# Altium project project_name.PrjPcb
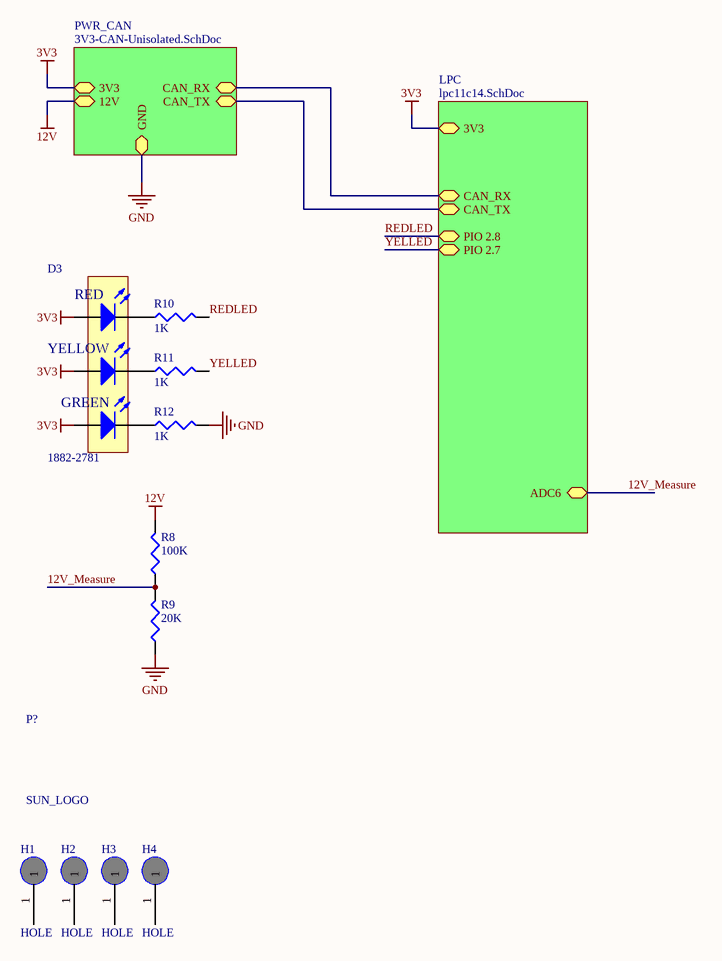
[diagram p0: project_name_lpc11c14.SchDoc]
6 sheets, 96 parts. Net scope: hierarchical (ports join the sheet entries above them; power ports are global).
Board files: project_name_faceplate.PcbDoc, CAN_faceplate.PcbDoc, project_name.PcbDoc
Sheets:
  project_name_lpc11c14.SchDoc
    LPC = lpc11c14.SchDoc
    PWR_CAN = 3V3-CAN-Unisolated.SchDoc
      U_3V-Switcher-50mA = 3V-Switcher-50mA.SchDoc
  project_name_lpc1768.SchDoc
    Unisolated CAN = 3V3-CAN-Unisolated.SchDoc
      U_3V-Switcher-50mA = 3V-Switcher-50mA.SchDoc
    LPC1768 = lpc1768.SchDoc

## Sheet project_name_lpc11c14.SchDoc
size A

### Parts
(Parts that share a designator on the sheet are numbered #1, #2 ... from top to bottom, then left to right.)
D3  1882-2781  [LED_TRILEVEL]
H1#1  HOLE  [M2.5]
H2#1  HOLE  [M2.5]
H3#1  HOLE  [M2.5]
H4#1  HOLE  [M2.5]
P?  SUN_LOGO  [SUNSWIFTLOGO]
R8  100K  [0603]
R9  20K  [0603]
R10  1K  [0603]
R11#1  1K  [0603]
R12#1  1K  [0603]

### Sub-sheets
LPC = lpc11c14.SchDoc: 3V3 (bidir), CAN_RX (bidir), CAN_TX (bidir), ADC6 (bidir), PIO 2.8 (bidir), PIO 2.7 (bidir)
PWR_CAN = 3V3-CAN-Unisolated.SchDoc: CAN_RX (bidir), CAN_TX (bidir), 3V3 (bidir), 12V (bidir), GND (bidir)

### Nets
3V3: D3.4(A) D3.5(A) D3.6(A) ; sheet LPC/3V3, sheet PWR_CAN/3V3  [project net VDDA]
12V: R8.2 ; sheet PWR_CAN/12V
GND: R9.1 R12#1.2 ; sheet PWR_CAN/GND  [project net VREFN]
12V_Measure: R8.1 R9.2 ; sheet LPC/ADC6
REDLED: R10.2 ; sheet LPC/PIO 2.8
YELLED: R11#1.2 ; sheet LPC/PIO 2.7
NetD3_1: D3.1(K) R12#1.1
NetD3_2: D3.2(K) R11#1.1
NetD3_3: D3.3(K) R10.1
NetU1_PWR_CAN_1: sheet LPC/CAN_TX, sheet PWR_CAN/CAN_TX
NetU1_PWR_CAN_4: sheet LPC/CAN_RX, sheet PWR_CAN/CAN_RX

Not connected (* = marked no-connect by the designer): H1#1 1; H2#1 1; H3#1 1; H4#1 1

### Notes on the sheet
- (in symbol LED-TRILEVEL) RED; YELLOW; GREEN

### Library data of the parts
D3 = LED-TRILEVEL: Three level LED; Needed?: Farnell - Low Stock; Farnell: 1461596; Farnell Price: 4.56
H1#1 H2#1 H3#1 H4#1 = HOLE: Needed?: NO - Footprint
R8-R10 R11#1 R12#1 = RES1: Resistor; Needed?: NO - HW LAB
  R8: Value: 100k
  R9: Value: 20k
  R10 R11#1 R12#1: Value: 1k

## Sheet lpc11c14.SchDoc
size A4; Organization: UNSW Solar Racing Team; Address3: UNSW; Address4: Sydney NSW 2052; Address2: Electrical Engineering; Address1: Rm 109
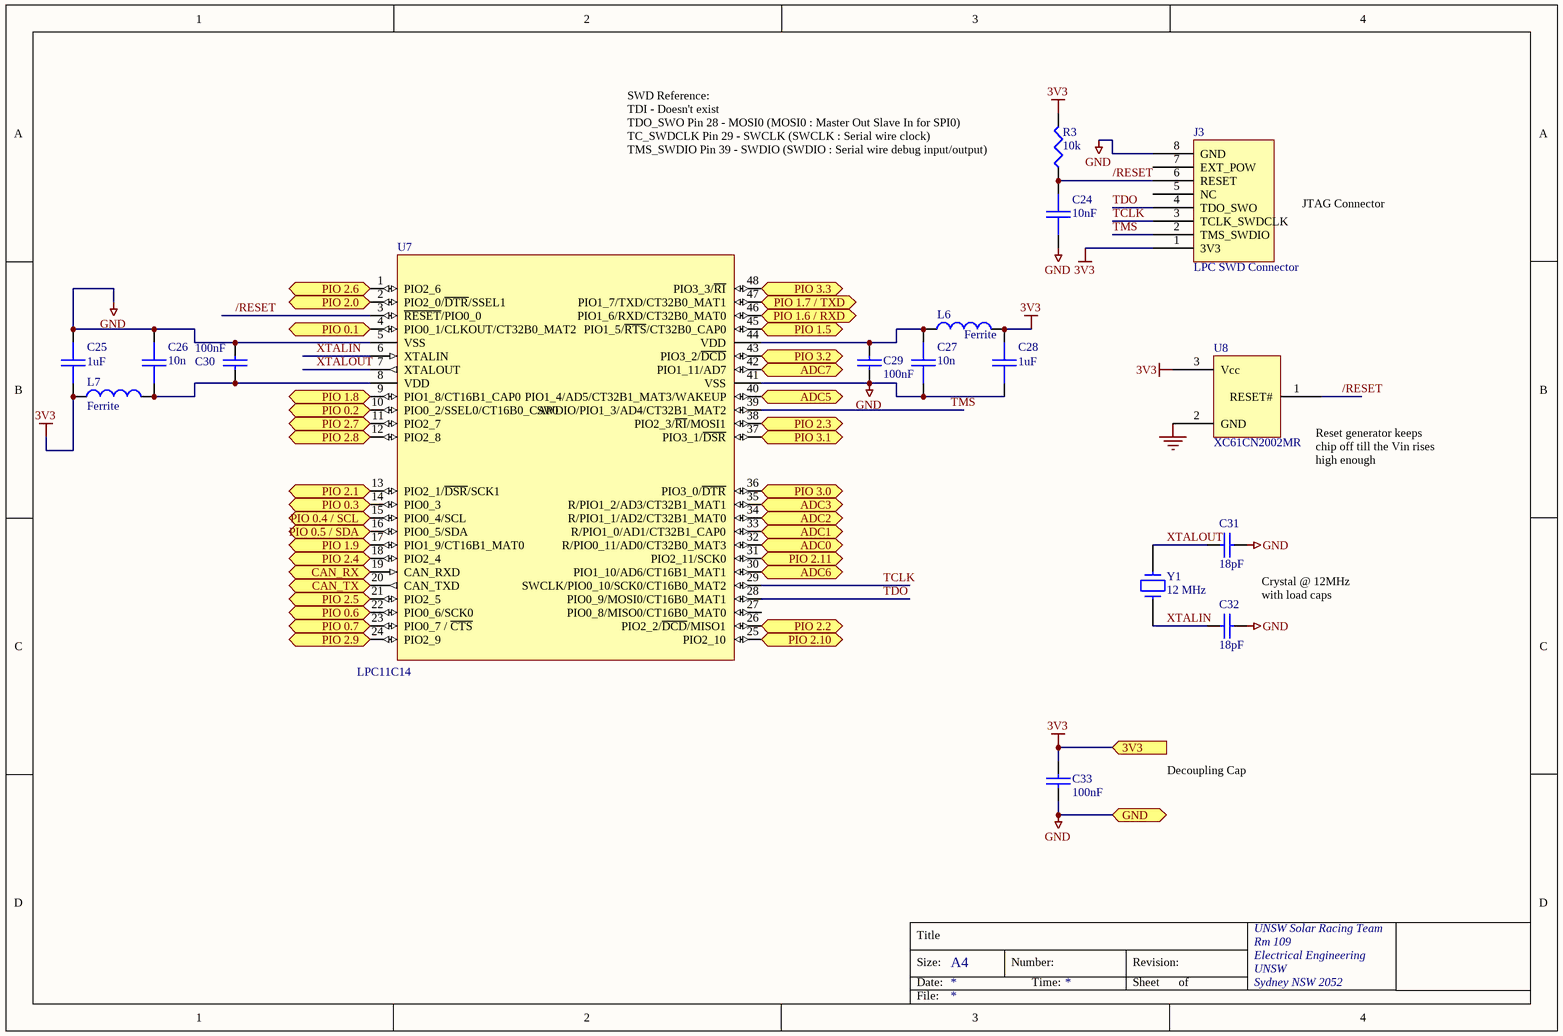
[diagram p1: lpc11c14.SchDoc]

### Parts
(Parts that share a designator on the sheet are numbered #1, #2 ... from top to bottom, then left to right.)
C24#1  10nF  [0603]
C25#1  value 1uF  [0603]  (hidden comment: 1u)
C26#1  10n  [0603]
C27  10n  [0603]
C28  value 1uF  [0603]  (hidden comment: 1u)
C29  100nF  [0603]
C30  100nF  [0603]
C31  18pF  [0603]
C32  18pF  [0603]
C33  100nF  [0603]
J3  LPC SWD Connector  [IDC8]
L6  Ferrite  [0603]
L7  Ferrite  [0603]
R3  10k  [0603]
U7  LPC11C14  [TSQFP50P900X900-48N]
U8  XC61CN2002MR  [SOT23(3)]
Y1#1  12 MHz  [HC49/4H]

### Ports
3V3, ADC0 (in), ADC1 (in), ADC2 (in), ADC3 (in), ADC5 (in), ADC6 (in), ADC7 (in), CAN_RX (in), CAN_TX (out), GND, PIO 0.1 (bidir), PIO 0.2 (bidir), PIO 0.3 (bidir), PIO 0.4 / SCL (bidir), PIO 0.5 / SDA (bidir), PIO 0.6 (bidir), PIO 0.7 (bidir), PIO 1.5 (bidir), PIO 1.6 / RXD (bidir), PIO 1.7 / TXD (bidir), PIO 1.8 (bidir), PIO 1.9 (bidir), PIO 2.0 (bidir), PIO 2.1 (bidir), PIO 2.2 (bidir), PIO 2.3 (bidir), PIO 2.4 (bidir), PIO 2.5 (bidir), PIO 2.6 (bidir), PIO 2.7 (bidir), PIO 2.8 (bidir), PIO 2.9 (bidir), PIO 2.10 (bidir), PIO 2.11 (bidir), PIO 3.0 (bidir), PIO 3.1 (bidir), PIO 3.2 (bidir), PIO 3.3 (bidir)

### Nets
3V3: C25#1.2 C28.1 C33.1 J3.1(3V3) L6.2 L7.1 R3.2 U8.3(Vcc) ; port 3V3  [project net VDDA]
GND: C24#1.2 C25#1.1 C26#1.1 C27.2 C28.2 C29.2 C30.1 C31.2 C32.2 C33.2 J3.8(GND) U7.5(VSS) U7.41(VSS) U8.2(GND) ; port GND  [project net VREFN]
12V_Measure: U7.30(PIO1_10/AD6/CT16B1_MAT1) ; port ADC6
/RESET: C24#1.1 J3.6(RESET) R3.1 U7.3(~{RESET}/PIO0_0) U8.1(RESET#)
REDLED: U7.12(PIO2_8) ; port PIO 2.8
TCLK: J3.3(TCLK_SWDCLK) U7.29(SWCLK/PIO0_10/SCK0/CT16B0_MAT2)
TDO: J3.4(TDO_SWO) U7.28(PIO0_9/MOSI0/CT16B0_MAT1)
TMS: J3.2(TMS_SWDIO) U7.39(SWDIO/PIO1_3/AD4/CT32B1_MAT2)
XTALIN: C32.1 U7.6(XTALIN) Y1#1.1
XTALOUT: C31.1 U7.7(XTALOUT) Y1#1.2
YELLED: U7.11(PIO2_7) ; port PIO 2.7
NetC26#1_2: C26#1.2 C30.2 L7.2 U7.8(VDD)
NetC27_1: C27.1 C29.1 L6.1 U7.44(VDD)
NetU1_PWR_CAN_1: U7.20(CAN_TXD) ; port CAN_TX
NetU1_PWR_CAN_4: U7.19(CAN_RXD) ; port CAN_RX
NetU7_1: U7.1(PIO2_6) ; port PIO 2.6
NetU7_2: U7.2(PIO2_0/~{DTR}/SSEL1) ; port PIO 2.0
NetU7_4: U7.4(PIO0_1/CLKOUT/CT32B0_MAT2) ; port PIO 0.1
NetU7_9: U7.9(PIO1_8/CT16B1_CAP0) ; port PIO 1.8
NetU7_10: U7.10(PIO0_2/SSEL0/CT16B0_CAP0) ; port PIO 0.2
NetU7_13: U7.13(PIO2_1/~{DSR}/SCK1) ; port PIO 2.1
NetU7_14: U7.14(PIO0_3) ; port PIO 0.3
NetU7_15: U7.15(PIO0_4/SCL) ; port PIO 0.4 / SCL
NetU7_16: U7.16(PIO0_5/SDA) ; port PIO 0.5 / SDA
NetU7_17: U7.17(PIO1_9/CT16B1_MAT0) ; port PIO 1.9
NetU7_18: U7.18(PIO2_4) ; port PIO 2.4
NetU7_21: U7.21(PIO2_5) ; port PIO 2.5
NetU7_22: U7.22(PIO0_6/SCK0) ; port PIO 0.6
NetU7_23: U7.23(PIO0_7_/_~{CTS}) ; port PIO 0.7
NetU7_24: U7.24(PIO2_9) ; port PIO 2.9
NetU7_25: U7.25(PIO2_10) ; port PIO 2.10
NetU7_26: U7.26(PIO2_2/~{DCD}/MISO1) ; port PIO 2.2
NetU7_31: U7.31(PIO2_11/SCK0) ; port PIO 2.11
NetU7_32: U7.32(R/PIO0_11/AD0/CT32B0_MAT3) ; port ADC0
NetU7_33: U7.33(R/PIO1_0/AD1/CT32B1_CAP0) ; port ADC1
NetU7_34: U7.34(R/PIO1_1/AD2/CT32B1_MAT0) ; port ADC2
NetU7_35: U7.35(R/PIO1_2/AD3/CT32B1_MAT1) ; port ADC3
NetU7_36: U7.36(PIO3_0/~{DTR}) ; port PIO 3.0
NetU7_37: U7.37(PIO3_1/~{DSR}) ; port PIO 3.1
NetU7_38: U7.38(PIO2_3/~{RI}/MOSI1) ; port PIO 2.3
NetU7_40: U7.40(PIO1_4/AD5/CT32B1_MAT3/WAKEUP) ; port ADC5
NetU7_42: U7.42(PIO1_11/AD7) ; port ADC7
NetU7_43: U7.43(PIO3_2/~{DCD}) ; port PIO 3.2
NetU7_45: U7.45(PIO1_5/~{RTS}/CT32B0_CAP0) ; port PIO 1.5
NetU7_46: U7.46(PIO1_6/RXD/CT32B0_MAT0) ; port PIO 1.6 / RXD
NetU7_47: U7.47(PIO1_7/TXD/CT32B0_MAT1) ; port PIO 1.7 / TXD
NetU7_48: U7.48(PIO3_3/~{RI}) ; port PIO 3.3

Not connected (* = marked no-connect by the designer): J3 5(NC) 7(EXT_POW); U7 27(PIO0_8/MISO0/CT16B0_MAT0)

### Notes on the sheet
- SWD Reference:
  TDI - Doesn't exist
  TDO_SWO Pin 28 - MOSI0 (MOSI0 : Master Out Slave In for SPI0)
  TC_SWDCLK Pin 29 - SWCLK (SWCLK : Serial wire clock)
  TMS_SWDIO Pin 39 - SWDIO (SWDIO : Serial wire debug input/output)
- JTAG Connector
- (near U8) Reset generator keeps chip off till the Vin rises high enough
- Crystal @ 12MHz with load caps
- Decoupling Cap
- Title
- Size:
- Date:
- A4
- Number:
- Time:
- Revision:
- Sheet
- of
- File:

### Library data of the parts
C24#1 C29 C30 C33 = CAP: Capacitor; Needed?: NO - HW LAB
  C24#1: Value: 10nF
  C29 C30 C33: Value: 100nF
C25#1 C28 = CAP: Capacitor; Needed?: RS; RS: 640-6404; RS Price: 0.06
C26#1 C27 = CAP: Capacitor; Value: 1nF; Needed?: NO - HW LAB; Revision: July-2002: Re-released for DXP Platform.
C31 C32 = CAP: Capacitor; Needed?: Farnell; Value: 18pF; Farnell: 1844169; Farnell Price: 0.025
J3 = LPCLink_Connector: Needed?: NO - Common
L6 L7 = INDUCTOR: Manufacturer: Generic Components; Needed?: Farnell; Published: 8-Jun-2000; Revision: July-2002: Re-released for DXP Platform.; Publisher: Altium Limited; Farnell: 1839565; Farnell Price: 0.65
R3 = RES1: Resistor; Needed?: NO - HW LAB; Value: 10k
U7 = LPC11C14_Full: Needed?: Farnell; Farnell: 1812185; Farnell Price: 8.38
U8 = XC61F: SOT23 reset generator; Needed?: Farnell; Farnell: 3605486; Farnell Price: 1.74
Y1#1 = CRYSTAL: Needed?: RS; RS: 693-8803; RS Price: 0.95

## Sheet 3V3-CAN-Unisolated.SchDoc
size A4; Organization: UNSW Solar Racing Team; Address3: UNSW; Address4: Sydney NSW 2052; Address2: Electrical Engineering; Address1: Rm 109
Used 2 times, as channels PWR_CAN, Unisolated CAN. Parts and nets are listed once, with the designators drawn on the sheet.
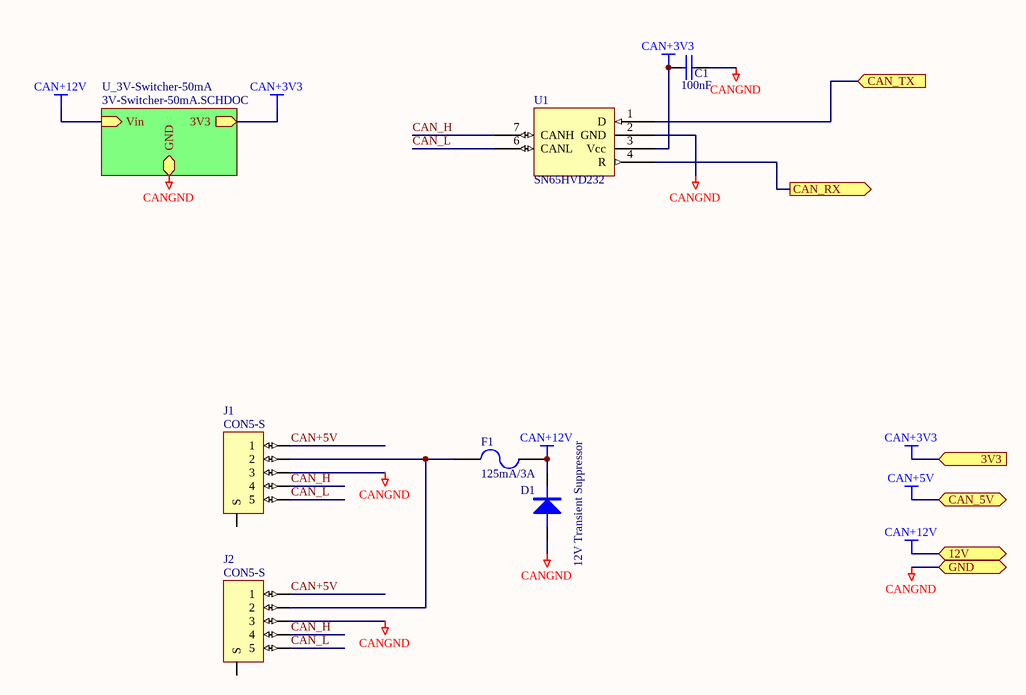
[diagram p2: 3V3-CAN-Unisolated.SchDoc]

### Parts
C1  100nF  [0603]
D1  12V Transient Suppressor  [SMA]
F1  125mA/3A  [LITTELFUSE-154]
J1  CON5-S  [TRIAD5F]
J2  CON5-S  [TRIAD5F]
U1  SN65HVD232  [SO8]

### Sub-sheets
U_3V-Switcher-50mA = 3V-Switcher-50mA.SCHDOC: GND, 3V3, Vin

### Ports
3V3, 12V, CAN_5V (bidir), CAN_RX (out), CAN_TX (in), GND

### Nets
CAN+3V3: C1.2 U1.3(Vcc) ; port 3V3, sheet U_3V-Switcher-50mA/3V3
CAN+5V: J1.1 J2.1 ; port CAN_5V
CAN+12V: D1.K F1.2 ; port 12V, sheet U_3V-Switcher-50mA/Vin
CANGND: C1.1 D1.A J1.3 J2.3 U1.2(GND) ; port GND, sheet U_3V-Switcher-50mA/GND
CAN_H: J1.4 J2.4 U1.7(CANH)
CAN_L: J1.5 J2.5 U1.6(CANL)
CAN_RX: U1.4(R) ; port CAN_RX
CAN_TX: U1.1(D) ; port CAN_TX
NetF1_1: F1.1 J1.2 J2.2

Not connected (* = marked no-connect by the designer): J1 0(S); J2 0(S)

### Channels
PWR_CAN: designators end in _PWR_CAN; ports 3V3=VDDA 12V=12V CAN_5V=CAN+5V CAN_RX=NetU1_PWR_CAN_4 CAN_TX=NetU1_PWR_CAN_1 GND=VREFN
Unisolated CAN: designators end in _Unisolated_CAN; ports 3V3=VDDA 12V=12V CAN_5V=CAN+5V CAN_RX=CCAN_RX CAN_TX=CCAN_TX GND=VREFN

### Notes on the sheet
- Title
- Size:
- Date:
- A4
- Number:
- Time:
- Revision:
- Sheet
- of
- File:

### Library data of the parts
C1 = CAP: Capacitor; Farnell: 753-567; Price: 0.31
D1 = DIODE: Farnell: 302-3096; Price: 1.25
F1 = FUSE2: Fuse; Farnell: 664-893; Other Info: www.littelfuse.com; Price: 5.67
J1 J2 = CON5-S: Connector, 2 pin, with shield @ S; Farnell: .131-040; Price: 19.32
U1 = SN65HVD232: 3.3V CAN Transciever; Farnell: NA

## Sheet 3V-Switcher-50mA.SchDoc
size A4; Organization: UNSW Solar Racing Team; Address3: UNSW; Address4: Sydney NSW 2052; Address2: Electrical Engineering; Address1: Rm 109
Used 2 times, as channels PWR_CAN/U_3V-Switcher-50mA, Unisolated CAN/U_3V-Switcher-50mA. Parts and nets are listed once, with the designators drawn on the sheet.
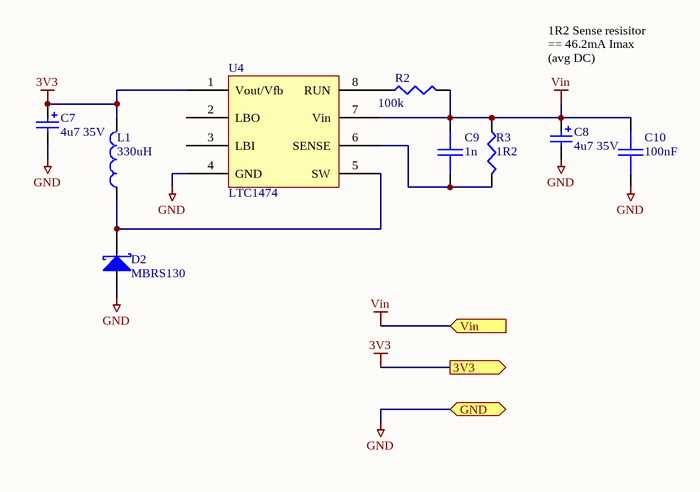
[diagram p3: 3V-Switcher-50mA.SchDoc]

### Parts
C7  4u7 35V  [MCCT-CASEC]
C8  4u7 35V  [MCCT-CASEC]
C9  1n  [0603]
C10  100nF  [0603]
D2  MBRS130  [SMB]
L1  330uH  [1812]
R2  100k  [0603]
R3  1R2  [0603]
U4  LTC1474  [SO8]

### Ports
3V3, GND, Vin (in)

### Nets
3V3: C7.1 L1.2 U4.1(Vout/Vfb) ; port 3V3
GND: C7.2 C8.2 C10.2 D2.A U4.4(GND) ; port GND
Vin: C8.1 C9.1 C10.1 R2.2 R3.1 U4.7(Vin) ; port Vin
NetC9_2: C9.2 R3.2 U4.6(SENSE)
NetD2_K: D2.K L1.1 U4.5(SW)
NetR2_1: R2.1 U4.8(RUN)

Not connected (* = marked no-connect by the designer): U4 2(LBO) 3(LBI)

### Channels
PWR_CAN/U_3V-Switcher-50mA: designators end in _PWR_CAN_U_3V-Switcher-50mA; ports 3V3=VDDA GND=VREFN Vin=12V
Unisolated CAN/U_3V-Switcher-50mA: designators end in _Unisolated_CAN_U_3V-Switcher-50mA; ports 3V3=VDDA GND=VREFN Vin=12V

### Notes on the sheet
- 1R2 Sense resisitor == 46.2mA Imax (avg DC)
- Title
- Size:
- Date:
- A4
- Number:
- Time:
- Revision:
- Sheet
- of
- File:

### Library data of the parts
C7 C8 = Cap Pol3: Polarized Capacitor (Surface Mount); Value: 4.7uF; Revision: July-2002: Re-released for DXP Platform.; Farnell: 967-294; Price: 1.97
C9 = CAP: Capacitor; Value: 1nF; Revision: July-2002: Re-released for DXP Platform.; Farnell: 317-202; Price: 0.15
C10 = CAP: Capacitor; Value: 0.1uF; Revision: July-2002: Re-released for DXP Platform.; Farnell: 753-567; Price: 0.31
D2 = D SCHOTTKY: Schottky Diode; Revision: July-2002: Re-released for DXP Platform.; Farnell: 708-150; Price: 1.49
L1 = Inductor: Revision: July-2002: Re-released for DXP Platform.; Value: 330uH; Farnell: 200-451; Price: 2.90
R2 = RES1: Resistor; Value: 100k; Farnell: 612-728; Price: 0.13
R3 = RES1: Resistor; Value: 1.2R; Revision: July-2002: Re-released for DXP Platform.; Farnell: 360-2229; Price: 0.15
U4 = LTC1474: Step-down converter; Farnell: NA

## Sheet project_name_lpc1768.SchDoc
size A4
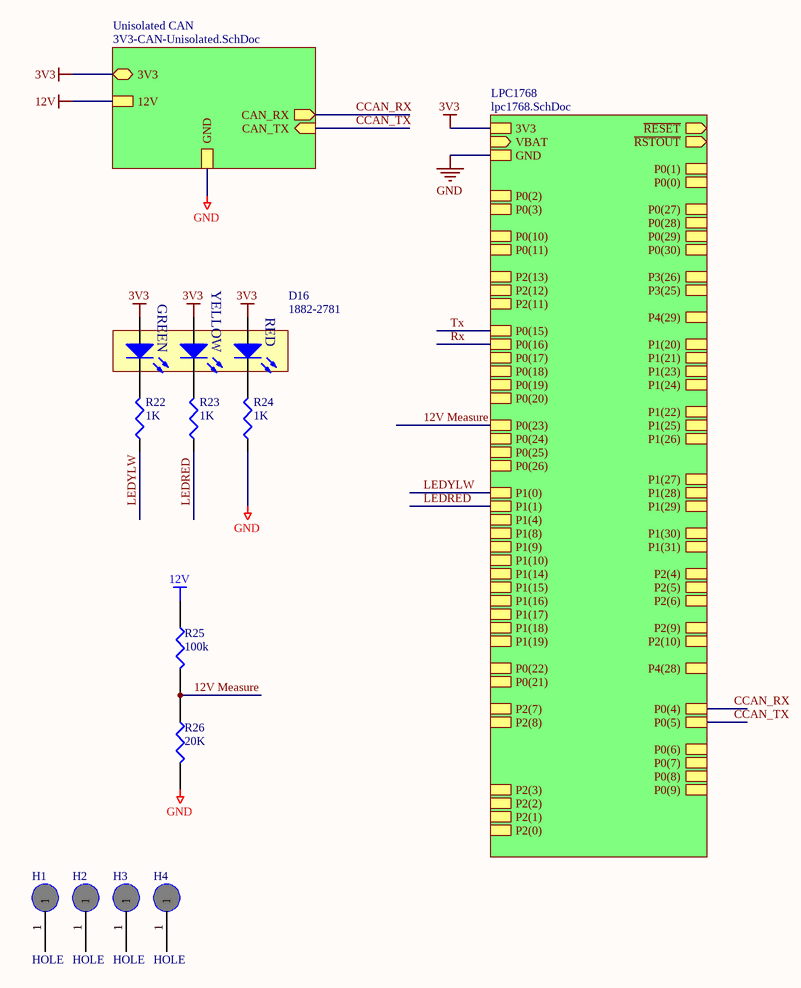
[diagram p4: project_name_lpc1768.SchDoc]

### Parts
(Parts that share a designator on the sheet are numbered #1, #2 ... from top to bottom, then left to right.)
D16  1882-2781  [LED_TRILEVEL]
H1#2  HOLE  [M2.5]
H2#2  HOLE  [M2.5]
H3#2  HOLE  [M2.5]
H4#2  HOLE  [M2.5]
R22  1K  [0603]
R23  1K  [0603]
R24  1K  [0603]
R25  100k  [1206]
R26  20K  [1206]

### Sub-sheets
LPC1768 = lpc1768.SchDoc: P0(26), P0(25), P0(24), P0(23), P1(31), P1(30), P0(28), P0(27), P3(26), P3(25), P0(29), P0(30), P1(18), P1(19), P1(20), P1(21), P1(22), P1(24), P1(23), P1(25), P1(26), P1(27), P1(28), P1(29), P0(0), P0(1), P0(10), P0(11), P2(13), P2(12), P2(11), P2(10), P0(22), P0(21), P0(20), P0(19), P0(18), P0(17), P0(15), P0(16), P2(9), P2(8), P2(7), P2(6), P2(5), P2(4), P2(3), P2(2), P2(1), P2(0), P0(2), P0(3), P1(0), P1(1), P1(4), P1(8), P1(9), P1(10), P1(14), P1(15), P1(16), P1(17), P0(4), P0(5), P0(6), P0(7), P0(8), P0(9), P4(29), P4(28), GND, 3V3, ~{RSTOUT}, ~{RESET}, VBAT (in)
Unisolated CAN = 3V3-CAN-Unisolated.SchDoc: 12V, GND, 3V3, CAN_RX (out), CAN_TX (in)

### Nets
3V3: D16.4(A) D16.5(A) D16.6(A) ; sheet Unisolated CAN/3V3, sheet LPC1768/3V3  [project net VDDA]
12V: R25.1 ; sheet Unisolated CAN/12V
GND: R24.1 R26.2 ; sheet Unisolated CAN/GND, sheet LPC1768/GND  [project net VREFN]
12V Measure: R25.2 R26.1 ; sheet LPC1768/P0(23)
CCAN_RX: sheet Unisolated CAN/CAN_RX, sheet LPC1768/P0(4)
CCAN_TX: sheet Unisolated CAN/CAN_TX, sheet LPC1768/P0(5)
LEDRED: R23.1 ; sheet LPC1768/P1(1)
LEDYLW: R22.1 ; sheet LPC1768/P1(0)
NetD16_1: D16.1(K) R22.2
NetD16_2: D16.2(K) R23.2
NetD16_3: D16.3(K) R24.2

Not connected (* = marked no-connect by the designer): H1#2 1; H2#2 1; H3#2 1; H4#2 1

### Notes on the sheet
- (in symbol LED-TRILEVEL) YELLOW; GREEN; RED

### Library data of the parts
D16 = LED-TRILEVEL: Three level LED; Element14 (low stock): 1461596; Element14 Price: 4.56; Digikey: 350-1751-ND; Digikey Price: 2.84
R22-R24 = RES1: Resistor; Farnell: *
R25 R26 = RES1: Price: 1.010
  R25: Farnell: 308-6422
  R26: Farnell: 308-6252

## Sheet lpc1768.SchDoc: LPC1768
size A4; Organization: UNSW Solar Racing Team; Address3: UNSW; Address4: Sydney NSW 2052; Address2: Electrical Engineering; Address1: Room 342
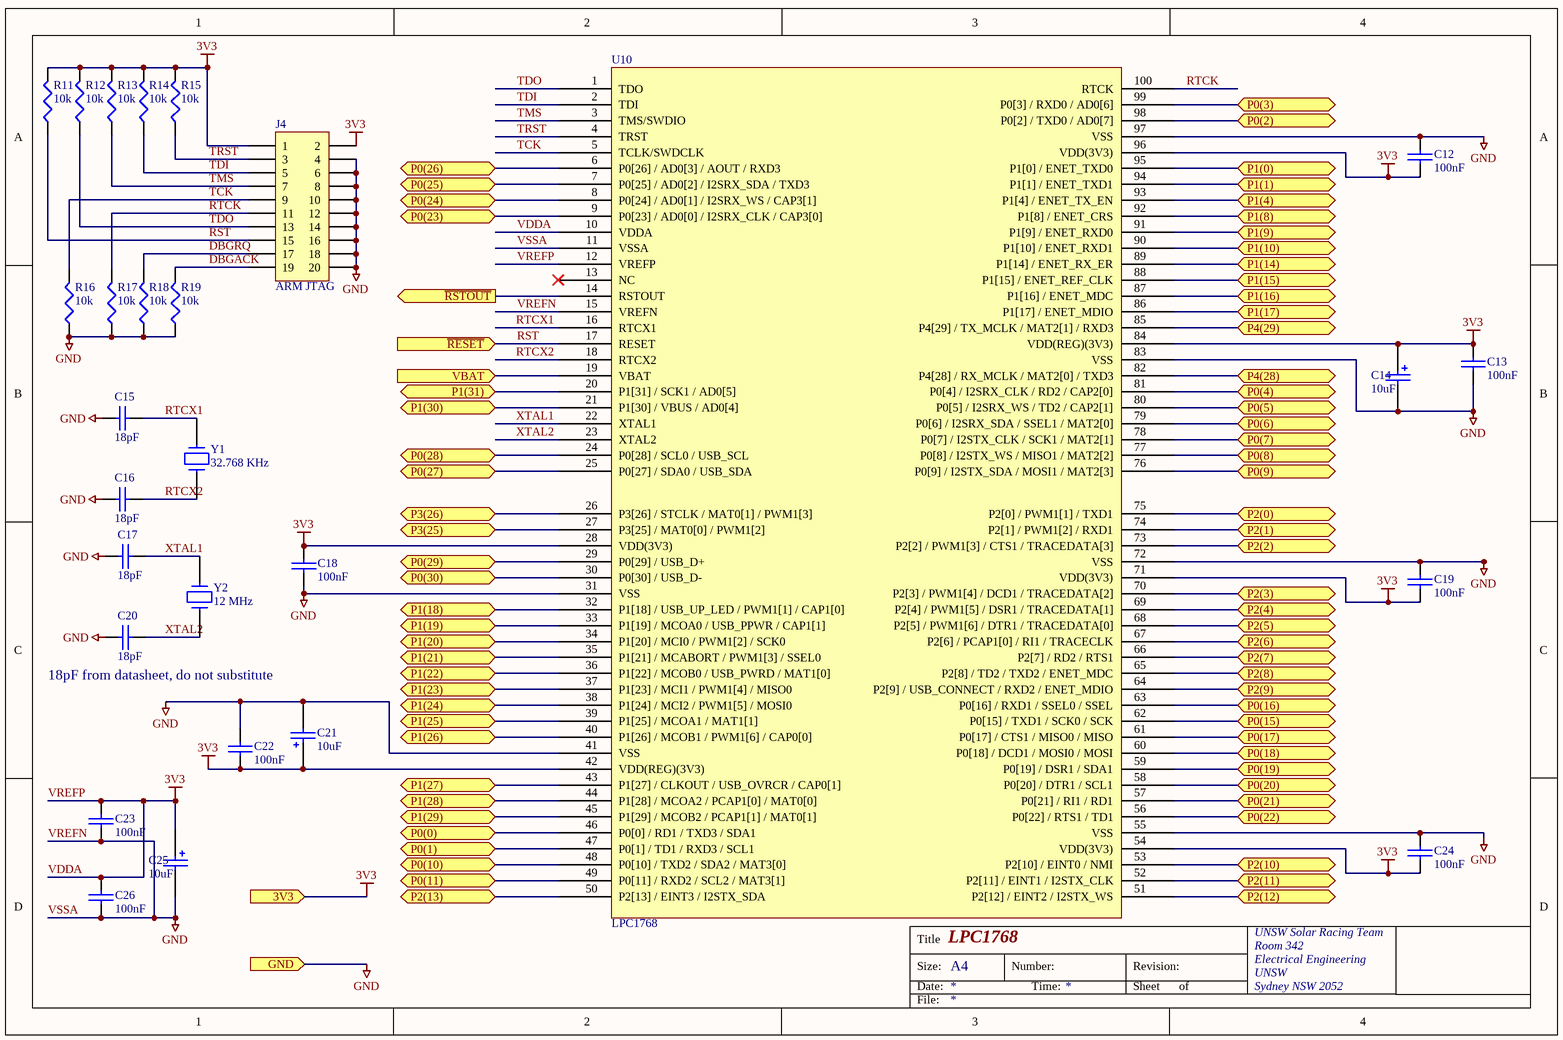
[diagram p5: lpc1768.SchDoc]

### Parts
(Parts that share a designator on the sheet are numbered #1, #2 ... from top to bottom, then left to right.)
C12  100nF  [0603]
C13  100nF  [0603]
C14  10uF  [MCCT-CASEA]
C15  18pF  [0603]
C16  18pF  [0603]
C17  18pF  [0603]
C18  100nF  [0603]
C19  100nF  [0603]
C20  18pF  [0603]
C21  10uF  [MCCT-CASEA]
C22  100nF  [0603]
C23  100nF  [0603]
C24#2  100nF  [0603]
C25#2  10uF  [MCCT-CASEA]
C26#2  100nF  [0603]
J4  ARM JTAG  [HDR2X10]
R11#2  10k  [0603]
R12#2  10k  [0603]
R13  10k  [0603]
R14  10k  [0603]
R15  10k  [0603]
R16  10k  [0603]
R17  10k  [0603]
R18  10k  [0603]
R19  10k  [0603]
U10  LPC1768  [QFP100]
Y1#2  32.768 KHz  [WATCHA]
Y2  12 MHz  [HC49/4H]

### Ports
3V3, GND, P0(0), P0(1), P0(2), P0(3), P0(4), P0(5), P0(6), P0(7), P0(8), P0(9), P0(10), P0(11), P0(15), P0(16), P0(17), P0(18), P0(19), P0(20), P0(21), P0(22), P0(23), P0(24), P0(25), P0(26), P0(27), P0(28), P0(29), P0(30), P1(0), P1(1), P1(4), P1(8), P1(9), P1(10), P1(14), P1(15), P1(16), P1(17), P1(18), P1(19), P1(20), P1(21), P1(22), P1(23), P1(24), P1(25), P1(26), P1(27), P1(28), P1(29), P1(30), P1(31), P2(0), P2(1), P2(2), P2(3), P2(4), P2(5), P2(6), P2(7), P2(8), P2(9), P2(10), P2(11), P2(12), P2(13), P3(25), P3(26), P4(28), P4(29), VBAT (in), ~{RESET} (in), ~{RSTOUT} (out)

### Nets
VDDA: C12.2 C13.1 C14.1 C18.1 C19.2 C21.1 C22.2 C23.1 C24#2.2 C25#2.1 C26#2.1 J4.1 J4.2 R11#2.2 R12#2.2 R13.2 R14.2 R15.2 U10.10(VDDA) U10.12(VREFP) U10.28(VDD(3V3)) U10.42(VDD(REG)(3V3)) U10.54(VDD(3V3)) U10.71(VDD(3V3)) U10.84(VDD(REG)(3V3)) U10.96(VDD(3V3)) ; port 3V3  [also labelled 3V3, VREFP]
VREFN: C12.1 C13.2 C14.2 C15.2 C16.2 C17.2 C18.2 C19.1 C20.2 C21.2 C22.1 C23.2 C24#2.1 C25#2.2 C26#2.2 J4.4 J4.6 J4.8 J4.10 J4.12 J4.14 J4.16 J4.18 J4.20 R16.1 R17.1 R18.1 R19.1 U10.11(VSSA) U10.15(VREFN) U10.31(VSS) U10.41(VSS) U10.55(VSS) U10.72(VSS) U10.83(VSS) U10.97(VSS) ; port GND  [also labelled GND, VSSA]
12V Measure: U10.9(P0[23]_/_AD0[0]_/_I2SRX_CLK_/_CAP3[0]) ; port P0(23)
CCAN_RX: U10.81(P0[4]_/_I2SRX_CLK_/_RD2_/_CAP2[0]) ; port P0(4)
CCAN_TX: U10.80(P0[5]_/_I2SRX_WS_/_TD2_/_CAP2[1]) ; port P0(5)
DBGACK: J4.19 R19.2
DBGRQ: J4.17 R18.2
LEDRED: U10.94(P1[1]_/_ENET_TXD1) ; port P1(1)
LEDYLW: U10.95(P1[0]_/_ENET_TXD0) ; port P1(0)
RST: J4.15 R11#2.1 U10.17(RESET) ; port ~{RESET}
RTCK: J4.11 R17.2 U10.100(RTCK)
RTCX1: C15.1 U10.16(RTCX1) Y1#2.2
RTCX2: C16.1 U10.18(RTCX2) Y1#2.1
Rx: U10.63(P0[16]_/_RXD1_/_SSEL0_/_SSEL) ; port P0(16)
TCK: J4.9 R16.2 U10.5(TCLK/SWDCLK)
TDI: J4.5 R14.1 U10.2(TDI)
TDO: J4.13 R12#2.1 U10.1(TDO)
TMS: J4.7 R13.1 U10.3(TMS/SWDIO)
TRST: J4.3 R15.1 U10.4(TRST)
Tx: U10.62(P0[15]_/_TXD1_/_SCK0_/_SCK) ; port P0(15)
XTAL1: C17.1 U10.22(XTAL1) Y2.1
XTAL2: C20.1 U10.23(XTAL2) Y2.2
NetU10_6: U10.6(P0[26]_/_AD0[3]_/_AOUT_/_RXD3) ; port P0(26)
NetU10_7: U10.7(P0[25]_/_AD0[2]_/_I2SRX_SDA_/_TXD3) ; port P0(25)
NetU10_8: U10.8(P0[24]_/_AD0[1]_/_I2SRX_WS_/_CAP3[1]) ; port P0(24)
NetU10_14: U10.14(RSTOUT) ; port ~{RSTOUT}
NetU10_19: U10.19(VBAT) ; port VBAT
NetU10_20: U10.20(P1[31]_/_SCK1_/_AD0[5]) ; port P1(31)
NetU10_21: U10.21(P1[30]_/_VBUS_/_AD0[4]) ; port P1(30)
NetU10_24: U10.24(P0[28]_/_SCL0_/_USB_SCL) ; port P0(28)
NetU10_25: U10.25(P0[27]_/_SDA0_/_USB_SDA) ; port P0(27)
NetU10_26: U10.26(P3[26]_/_STCLK_/_MAT0[1]_/_PWM1[3]) ; port P3(26)
NetU10_27: U10.27(P3[25]_/_MAT0[0]_/_PWM1[2]) ; port P3(25)
NetU10_29: U10.29(P0[29]_/_USB_D+) ; port P0(29)
NetU10_30: U10.30(P0[30]_/_USB_D-) ; port P0(30)
NetU10_32: U10.32(P1[18]_/_USB_UP_LED_/_PWM1[1]_/_CAP1[0]) ; port P1(18)
NetU10_33: U10.33(P1[19]_/_MCOA0_/_USB_PPWR_/_CAP1[1]) ; port P1(19)
NetU10_34: U10.34(P1[20]_/_MCI0_/_PWM1[2]_/_SCK0) ; port P1(20)
NetU10_35: U10.35(P1[21]_/_MCABORT_/_PWM1[3]_/_SSEL0) ; port P1(21)
NetU10_36: U10.36(P1[22]_/_MCOB0_/_USB_PWRD_/_MAT1[0]) ; port P1(22)
NetU10_37: U10.37(P1[23]_/_MCI1_/_PWM1[4]_/_MISO0) ; port P1(23)
NetU10_38: U10.38(P1[24]_/_MCI2_/_PWM1[5]_/_MOSI0) ; port P1(24)
NetU10_39: U10.39(P1[25]_/_MCOA1_/_MAT1[1]) ; port P1(25)
NetU10_40: U10.40(P1[26]_/_MCOB1_/_PWM1[6]_/_CAP0[0]) ; port P1(26)
NetU10_43: U10.43(P1[27]_/_CLKOUT_/_USB_OVRCR_/_CAP0[1]) ; port P1(27)
NetU10_44: U10.44(P1[28]_/_MCOA2_/_PCAP1[0]_/_MAT0[0]) ; port P1(28)
NetU10_45: U10.45(P1[29]_/_MCOB2_/_PCAP1[1]_/_MAT0[1]) ; port P1(29)
NetU10_46: U10.46(P0[0]_/_RD1_/_TXD3_/_SDA1) ; port P0(0)
NetU10_47: U10.47(P0[1]_/_TD1_/_RXD3_/_SCL1) ; port P0(1)
NetU10_48: U10.48(P0[10]_/_TXD2_/_SDA2_/_MAT3[0]) ; port P0(10)
NetU10_49: U10.49(P0[11]_/_RXD2_/_SCL2_/_MAT3[1]) ; port P0(11)
NetU10_50: U10.50(P2[13]_/_EINT3_/_I2STX_SDA) ; port P2(13)
NetU10_51: U10.51(P2[12]_/_EINT2_/_I2STX_WS) ; port P2(12)
NetU10_52: U10.52(P2[11]_/_EINT1_/_I2STX_CLK) ; port P2(11)
NetU10_53: U10.53(P2[10]_/_EINT0_/_NMI) ; port P2(10)
NetU10_56: U10.56(P0[22]_/_RTS1_/_TD1) ; port P0(22)
NetU10_57: U10.57(P0[21]_/_RI1_/_RD1) ; port P0(21)
NetU10_58: U10.58(P0[20]_/_DTR1_/_SCL1) ; port P0(20)
NetU10_59: U10.59(P0[19]_/_DSR1_/_SDA1) ; port P0(19)
NetU10_60: U10.60(P0[18]_/_DCD1_/_MOSI0_/_MOSI) ; port P0(18)
NetU10_61: U10.61(P0[17]_/_CTS1_/_MISO0_/_MISO) ; port P0(17)
NetU10_64: U10.64(P2[9]_/_USB_CONNECT_/_RXD2_/_ENET_MDIO) ; port P2(9)
NetU10_65: U10.65(P2[8]_/_TD2_/_TXD2_/_ENET_MDC) ; port P2(8)
NetU10_66: U10.66(P2[7]_/_RD2_/_RTS1) ; port P2(7)
NetU10_67: U10.67(P2[6]_/_PCAP1[0]_/_RI1_/_TRACECLK) ; port P2(6)
NetU10_68: U10.68(P2[5]_/_PWM1[6]_/_DTR1_/_TRACEDATA[0]) ; port P2(5)
NetU10_69: U10.69(P2[4]_/_PWM1[5]_/_DSR1_/_TRACEDATA[1]) ; port P2(4)
NetU10_70: U10.70(P2[3]_/_PWM1[4]_/_DCD1_/_TRACEDATA[2]) ; port P2(3)
NetU10_73: U10.73(P2[2]_/_PWM1[3]_/_CTS1_/_TRACEDATA[3]) ; port P2(2)
NetU10_74: U10.74(P2[1]_/_PWM1[2]_/_RXD1) ; port P2(1)
NetU10_75: U10.75(P2[0]_/_PWM1[1]_/_TXD1) ; port P2(0)
NetU10_76: U10.76(P0[9]_/_I2STX_SDA_/_MOSI1_/_MAT2[3]) ; port P0(9)
NetU10_77: U10.77(P0[8]_/_I2STX_WS_/_MISO1_/_MAT2[2]) ; port P0(8)
NetU10_78: U10.78(P0[7]_/_I2STX_CLK_/_SCK1_/_MAT2[1]) ; port P0(7)
NetU10_79: U10.79(P0[6]_/_I2SRX_SDA_/_SSEL1_/_MAT2[0]) ; port P0(6)
NetU10_82: U10.82(P4[28]_/_RX_MCLK_/_MAT2[0]_/_TXD3) ; port P4(28)
NetU10_85: U10.85(P4[29]_/_TX_MCLK_/_MAT2[1]_/_RXD3) ; port P4(29)
NetU10_86: U10.86(P1[17]_/_ENET_MDIO) ; port P1(17)
NetU10_87: U10.87(P1[16]_/_ENET_MDC) ; port P1(16)
NetU10_88: U10.88(P1[15]_/_ENET_REF_CLK) ; port P1(15)
NetU10_89: U10.89(P1[14]_/_ENET_RX_ER) ; port P1(14)
NetU10_90: U10.90(P1[10]_/_ENET_RXD1) ; port P1(10)
NetU10_91: U10.91(P1[9]_/_ENET_RXD0) ; port P1(9)
NetU10_92: U10.92(P1[8]_/_ENET_CRS) ; port P1(8)
NetU10_93: U10.93(P1[4]_/_ENET_TX_EN) ; port P1(4)
NetU10_98: U10.98(P0[2]_/_TXD0_/_AD0[7]) ; port P0(2)
NetU10_99: U10.99(P0[3]_/_RXD0_/_AD0[6]) ; port P0(3)

Not connected (* = marked no-connect by the designer): U10 13(NC)*

### Notes on the sheet
- 18pF from datasheet, do not substitute
- Title
- Size:
- Date:
- A4
- Number:
- Time:
- Revision:
- Sheet
- of
- File:

### Library data of the parts
C12 C13 C18 C19 C22 C23 C24#2 C26#2 = CAP: Capacitor; Farnell: 753-567; Price: 0.30
C14 C21 C25#2 = CAP POL3: Polarized Capacitor (Surface Mount); Revision: July-2002: Re-released for DXP Platform.; Digikey: 399-3687-1-ND; DigikeyPrice: 0.54; Farnell: 1650980; FarnellPrice: 0.786
C15-C17 C20 = CAP: Capacitor; Order#: 721-992; Price: 0.11; Supplier: Farnell
J4 = Header 10X2: Header, 10-Pin, Dual row; Farnell: 9733647; FarnellPrice: 3.38; Digikey: WM8146-ND; DigikeyPrice: 3.39
R11#2 R12#2 R13-R19 = RES1: Resistor
U10 = LPC1768: NXP Cortex-M3 Microcontroller, 100pin 100MHz; Farnell: 1718549; FarnellPrice: 18.94; Digikey: 568-4796-ND; DigikeyPrice: 11.44
Y1#2 Y2 = CRYSTAL
  Y1#2: Farnell: 1611828; FarnellPrice: 0.401; Digikey: 535-9032-ND; DigikeyPrice: 0.25
  Y2: Farnell: 7940142; FarnellPrice: 0.854; DigikeyPrice: 0.46; Digikey: 887-1013-ND

## Nets that join several sheets
12V: project_name_lpc11c14 (R8.2), PWR_CAN (D1_PWR_CAN.K F1_PWR_CAN.2), PWR_CAN/U_3V-Switcher-50mA (6 pins), project_name_lpc1768 (R25.1), Unisolated CAN (D1_Unisolated_CAN.K F1_Unisolated_CAN.2), Unisolated CAN/U_3V-Switcher-50mA (6 pins)
CAN+5V: PWR_CAN (J1_PWR_CAN.1 J2_PWR_CAN.1), Unisolated CAN (J1_Unisolated_CAN.1 J2_Unisolated_CAN.1)
VDDA: project_name_lpc11c14 (D3.4 D3.5 D3.6), lpc11c14 (8 pins), PWR_CAN (C1_PWR_CAN.2 U1_PWR_CAN.3), PWR_CAN/U_3V-Switcher-50mA (C7_PWR_CAN_U_3V-Switcher-50mA.1 L1_PWR_CAN_U_3V-Switcher-50mA.2 U4_PWR_CAN_U_3V-Switcher-50mA.1), project_name_lpc1768 (D16.4 D16.5 D16.6), Unisolated CAN (C1_Unisolated_CAN.2 U1_Unisolated_CAN.3), Unisolated CAN/U_3V-Switcher-50mA (C7_Unisolated_CAN_U_3V-Switcher-50mA.1 L1_Unisolated_CAN_U_3V-Switcher-50mA.2 U4_Unisolated_CAN_U_3V-Switcher-50mA.1), lpc1768 (26 pins)
VREFN: project_name_lpc11c14 (R9.1 R12#1.2), lpc11c14 (14 pins), PWR_CAN (5 pins), PWR_CAN/U_3V-Switcher-50mA (5 pins), project_name_lpc1768 (R24.1 R26.2), Unisolated CAN (5 pins), Unisolated CAN/U_3V-Switcher-50mA (5 pins), lpc1768 (36 pins)
12V Measure: project_name_lpc1768 (R25.2 R26.1), lpc1768 (U10.9)
12V_Measure: project_name_lpc11c14 (R8.1 R9.2), lpc11c14 (U7.30)
CCAN_RX: Unisolated CAN (U1_Unisolated_CAN.4), lpc1768 (U10.81)
CCAN_TX: Unisolated CAN (U1_Unisolated_CAN.1), lpc1768 (U10.80)
LEDRED: project_name_lpc1768 (R23.1), lpc1768 (U10.94)
LEDYLW: project_name_lpc1768 (R22.1), lpc1768 (U10.95)
NetU1_PWR_CAN_1: lpc11c14 (U7.20), PWR_CAN (U1_PWR_CAN.1)
NetU1_PWR_CAN_4: lpc11c14 (U7.19), PWR_CAN (U1_PWR_CAN.4)
REDLED: project_name_lpc11c14 (R10.2), lpc11c14 (U7.12)
YELLED: project_name_lpc11c14 (R11#1.2), lpc11c14 (U7.11)